# Altium project PCB_DUVBot_v0.00.PrjPCB
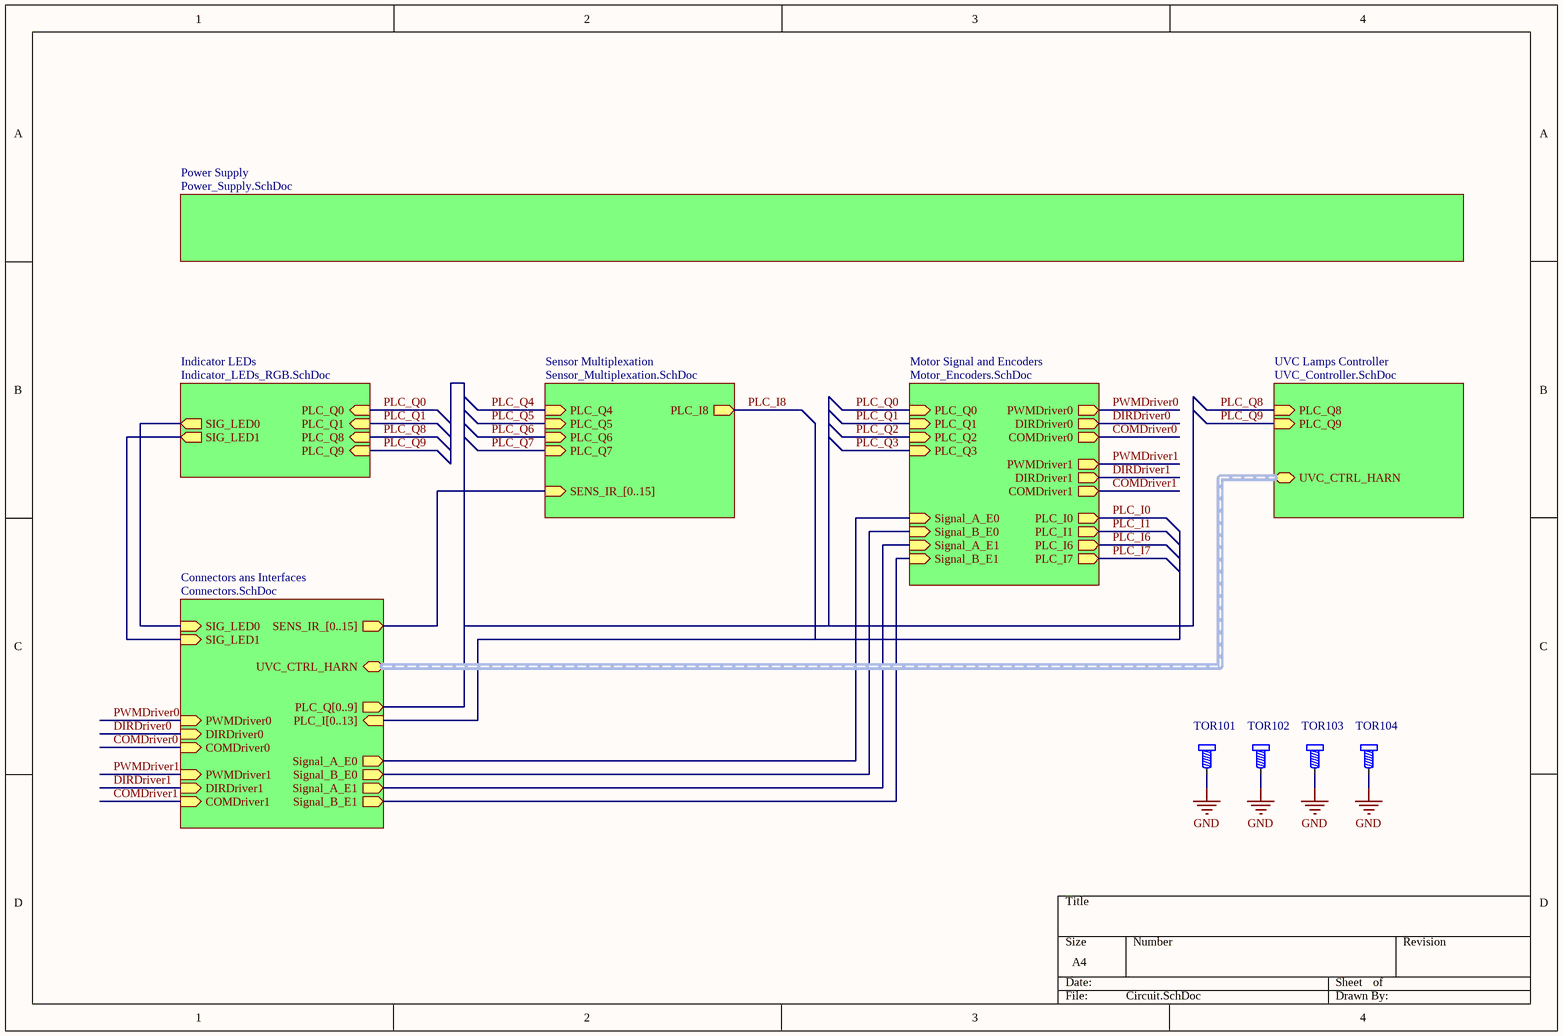
[diagram p0: Circuit.SchDoc]
7 sheets, 218 parts. Net scope: hierarchical (ports join the sheet entries above them; power ports are global).
Board file: PCB_DUVBot_v0.00.PcbDoc
Sheets:
  Circuit.SchDoc
    Indicator LEDs = Indicator_LEDs_RGB.SchDoc
    Sensor Multiplexation = Sensor_Multiplexation.SchDoc
    Power Supply = Power_Supply.SchDoc
    Motor Signal and Encoders = Motor_Encoders.SchDoc
    UVC Lamps Controller = UVC_Controller.SchDoc
    Connectors ans Interfaces = Connectors.SchDoc

## Sheet Circuit.SchDoc
size A4

### Parts
TOR101  SUJETADOR  [TOR_ALEM_M3]  (value not drawn)
TOR102  SUJETADOR  [TOR_ALEM_M3]  (value not drawn)
TOR103  SUJETADOR  [TOR_ALEM_M3]  (value not drawn)
TOR104  SUJETADOR  [TOR_ALEM_M3]  (value not drawn)

### Sub-sheets
Connectors ans Interfaces = Connectors.SchDoc: SENS_IR_[0..15] (out), UVC_CTRL_HARN (harness UVC_CTRL_HARN), PLC_Q[0..9] (out), PLC_I[0..13] (in), Signal_A_E0 (out), Signal_B_E0 (out), Signal_A_E1 (out), Signal_B_E1 (out), PWMDriver0 (in), DIRDriver0 (in), COMDriver0 (in), PWMDriver1 (in), DIRDriver1 (in), COMDriver1 (in), SIG_LED0 (in), SIG_LED1 (in)
Indicator LEDs = Indicator_LEDs_RGB.SchDoc: PLC_Q8 (in), PLC_Q9 (in), PLC_Q0 (in), PLC_Q1 (in), SIG_LED0 (out), SIG_LED1 (out)
Motor Signal and Encoders = Motor_Encoders.SchDoc: PLC_I0 (out), PLC_I6 (out), PLC_Q0 (in), PLC_Q2 (in), PLC_I1 (out), PLC_I7 (out), PLC_Q1 (in), PLC_Q3 (in), DIRDriver0 (out), COMDriver0 (out), DIRDriver1 (out), COMDriver1 (out), Signal_A_E0 (in), Signal_B_E0 (in), Signal_A_E1 (in), Signal_B_E1 (in), PWMDriver0 (out), PWMDriver1 (out)
Power Supply = Power_Supply.SchDoc: no entries
Sensor Multiplexation = Sensor_Multiplexation.SchDoc: SENS_IR_[0..15] (in), PLC_Q4 (in), PLC_Q5 (in), PLC_Q6 (in), PLC_Q7 (in), PLC_I8 (out)
UVC Lamps Controller = UVC_Controller.SchDoc: PLC_Q8 (in), PLC_Q9 (in), UVC_CTRL_HARN (harness UVC_CTRL_HARN)

### Nets
GND: TOR101.1 TOR102.1 TOR103.1 TOR104.1
COMDriver0: sheet Motor Signal and Encoders/COMDriver0, sheet Connectors ans Interfaces/COMDriver0
COMDriver1: sheet Motor Signal and Encoders/COMDriver1, sheet Connectors ans Interfaces/COMDriver1
DIRDriver0: sheet Motor Signal and Encoders/DIRDriver0, sheet Connectors ans Interfaces/DIRDriver0
DIRDriver1: sheet Motor Signal and Encoders/DIRDriver1, sheet Connectors ans Interfaces/DIRDriver1
PLC_Q0: sheet Indicator LEDs/PLC_Q0, sheet Motor Signal and Encoders/PLC_Q0
PLC_Q1: sheet Indicator LEDs/PLC_Q1, sheet Motor Signal and Encoders/PLC_Q1
PLC_Q8: sheet Indicator LEDs/PLC_Q8, sheet UVC Lamps Controller/PLC_Q8
PLC_Q9: sheet Indicator LEDs/PLC_Q9, sheet UVC Lamps Controller/PLC_Q9
PWMDriver0: sheet Motor Signal and Encoders/PWMDriver0, sheet Connectors ans Interfaces/PWMDriver0
PWMDriver1: sheet Motor Signal and Encoders/PWMDriver1, sheet Connectors ans Interfaces/PWMDriver1
SIG_LED0: sheet Indicator LEDs/SIG_LED0, sheet Connectors ans Interfaces/SIG_LED0
SIG_LED1: sheet Indicator LEDs/SIG_LED1, sheet Connectors ans Interfaces/SIG_LED1
Signal_A_E0: sheet Motor Signal and Encoders/Signal_A_E0, sheet Connectors ans Interfaces/Signal_A_E0
Signal_A_E1: sheet Motor Signal and Encoders/Signal_A_E1, sheet Connectors ans Interfaces/Signal_A_E1
Signal_B_E0: sheet Motor Signal and Encoders/Signal_B_E0, sheet Connectors ans Interfaces/Signal_B_E0
Signal_B_E1: sheet Motor Signal and Encoders/Signal_B_E1, sheet Connectors ans Interfaces/Signal_B_E1

### Buses and harness runs
bus sheet Connectors ans Interfaces/SENS_IR_[0..15] = sheet Sensor Multiplexation/SENS_IR_[0..15]
harness sheet Connectors ans Interfaces/UVC_CTRL_HARN = sheet UVC Lamps Controller/UVC_CTRL_HARN

### Library data of the parts
TOR101-TOR104 = Tornillos Sujecion: Agujero para tornillo ed sujecion ed placa; PROVEEDOR: Bultor; CODIGO STI: *; FABRICANTE: *

## Sheet Indicator_LEDs_RGB.SchDoc
size A4
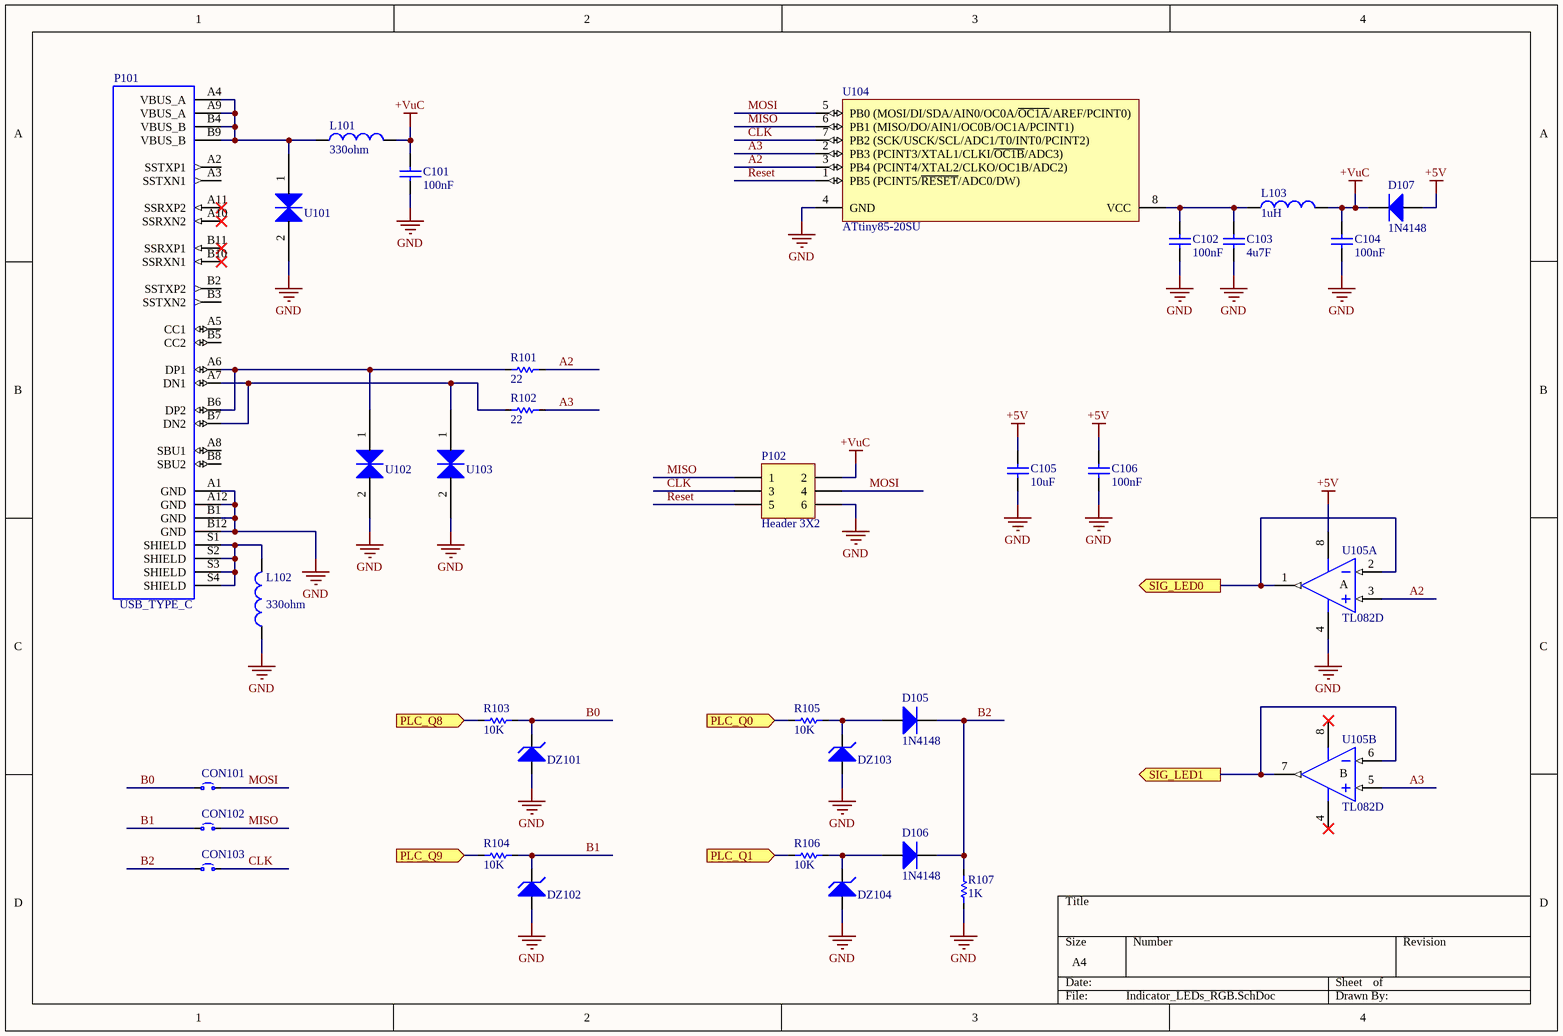
[diagram p1: Indicator_LEDs_RGB.SchDoc]

### Parts
C101  VALOR: 100nF  [C0603]  (hidden comment: Cap Ceramico SMD)
C102  VALOR: 100nF  [C0603]  (hidden comment: Cap Ceramico SMD)
C103  VALOR: 4u7F  [C0603]  (hidden comment: Cap Ceramico SMD)
C104  VALOR: 100nF  [C0603]  (hidden comment: Cap Ceramico SMD)
C105  VALOR: 10uF  [C0603]  (hidden comment: Cap Ceramico SMD)
C106  VALOR: 100nF  [C0603]  (hidden comment: Cap Ceramico SMD)
CON101  Puente  [PUENTE 0805]  (value not drawn)
CON102  Puente  [PUENTE 0805]  (value not drawn)
CON103  Puente  [PUENTE 0805]  (value not drawn)
D105  VALOR: 1N4148  [SOD-80]  (hidden comment: Diodo Rectificador SMD)
D106  VALOR: 1N4148  [SOD-80]  (hidden comment: Diodo Rectificador SMD)
D107  VALOR: 1N4148  [SOD-80]  (hidden comment: Diodo Rectificador SMD)
DZ101  Diodo Zenner SMD  [SOD-80]  (value not drawn)
DZ102  Diodo Zenner SMD  [SOD-80]  (value not drawn)
DZ103  Diodo Zenner SMD  [SOD-80]  (value not drawn)
DZ104  Diodo Zenner SMD  [SOD-80]  (value not drawn)
L101  value 330ohm  [J1-0603]  (hidden comment: Inductor)
L102  value 330ohm  [J1-0603]  (hidden comment: Inductor)
L103  value 1uH  [INDC1608L]  (hidden comment: Inductor)
P101  USB_TYPE_C  [USB_TYPE_C]
P102  Header 3X2  [HDR2X3]
R101  VALOR: 22  [R0603]  (hidden comment: Res SMD)
R102  VALOR: 22  [R0603]  (hidden comment: Res SMD)
R103  VALOR: 10K  [R0603]  (hidden comment: Res SMD)
R104  VALOR: 10K  [R0603]  (hidden comment: Res SMD)
R105  VALOR: 10K  [R0603]  (hidden comment: Res SMD)
R106  VALOR: 10K  [R0603]  (hidden comment: Res SMD)
R107  VALOR: 1K  [R0603]  (hidden comment: Res SMD)
U101  DIODE TVS BIDIR  [J1-0603]  (value not drawn)
U102  DIODE TVS BIDIR  [J1-0603]  (value not drawn)
U103  DIODE TVS BIDIR  [J1-0603]  (value not drawn)
U104  ATtiny85-20SU  [8S2_M]
U105  TL082D  [D008_L]  (parts A,B of 2)

### Ports
PLC_Q0 (in), PLC_Q1 (in), PLC_Q8 (in), PLC_Q9 (in), SIG_LED0 (out), SIG_LED1 (out)

### Nets
+5V: C105.1 C106.1 D107.1(A) U105.8(V+)
+VuC: C101.1 C104.1 D107.2(K) L101.2 L103.2 P102.2
GND: C101.2 C102.2 C103.1 C104.2 C105.2 C106.2 DZ101.1(A) DZ102.1(A) DZ103.1(A) DZ104.1(A) L102.1 P101.A1(GND) P101.A12(GND) P101.B1(GND) P101.B12(GND) P102.6 R107.2 U101.2 U102.2 U103.2 U104.4(GND) U105.4(V-)
A2: R101.1 U104.3(PB4_(PCINT4/XTAL2/CLKO/OC1B/ADC2)) U105.3(IN+)
A3: R102.1 U104.2(PB3_(PCINT3/XTAL1/CLKI/~{OC1B}/ADC3)) U105.5(IN+)
B0: CON101.1 DZ101.2(K) R103.2
B1: CON102.1 DZ102.2(K) R104.2
B2: CON103.1 D105.2(K) D106.2(K) R107.1
CLK: CON103.2 P102.3 U104.7(PB2_(SCK/USCK/SCL/ADC1/T0/INT0/PCINT2))
MISO: CON102.2 P102.1 U104.6(PB1_(MISO/DO/AIN1/OC0B/OC1A/PCINT1))
MOSI: CON101.2 P102.4 U104.5(PB0_(MOSI/DI/SDA/AIN0/OC0A/~{OC1A}/AREF/PCINT0))
PLC_Q0: R105.1 ; port PLC_Q0
PLC_Q1: R106.1 ; port PLC_Q1
PLC_Q8: R103.1 ; port PLC_Q8
PLC_Q9: R104.1 ; port PLC_Q9
Reset: P102.5 U104.1(PB5_(PCINT5/~{RESET}/ADC0/DW))
SIG_LED0: U105.1(OUT) U105.2(IN-) ; port SIG_LED0
SIG_LED1: U105.6(IN-) U105.7(OUT) ; port SIG_LED1
NetC102_1: C102.1 C103.2 L103.1 U104.8(VCC)
NetD105_1: D105.1(A) DZ103.2(K) R105.2
NetD106_1: D106.1(A) DZ104.2(K) R106.2
NetL101_1: L101.1 P101.A4(VBUS_A) P101.A9(VBUS_A) P101.B4(VBUS_B) P101.B9(VBUS_B) U101.1
NetL102_2: L102.2 P101.S1(SHIELD) P101.S2(SHIELD) P101.S3(SHIELD) P101.S4(SHIELD)
NetP101_A6: P101.A6(DP1) P101.B6(DP2) R101.2 U102.1
NetP101_A7: P101.A7(DN1) P101.B7(DN2) R102.2 U103.1

Not connected (* = marked no-connect by the designer): P101 A2(SSTXP1) A3(SSTXN1) A5(CC1) A8(SBU1) A10(SSRXN2)* A11(SSRXP2)* B2(SSTXP2) B3(SSTXN2) B5(CC2) B8(SBU2) B10(SSRXN1)* B11(SSRXP1)*

### Notes on the sheet
- (in symbol TL082D, part A) A
- (in symbol TL082D, part B) B

### Library data of the parts
C101-C106 = Cap Ceramico SMD: Cap Ceramico SMD 0805; CODIGO RUF: *; PROVEEDOR: *; FABRICANTE: *
  C101 C102 C104 C106: Arrow: C0603C104K5RACAUTO; Digikey: 399-6856-1-ND
  C103: Arrow: CL10A475KP8NNNC; Digikey: 1276-1044-1-ND
  C105: Arrow: CL10A106MQ8NNNC; Digikey: 1276-1119-1-ND
D105-D107 = Diodo Rectificador SMD: Diodo Rectificador; PROVEEDOR: *; CODIGO RUF: *; FABRIANTE: *; Arrow: FDLL4148; Digikey: FDLL4148TR-ND
DZ101 DZ102 DZ104 = Diodo Zenner SMD: VALOR: 5V1; PROVEEDOR: *; CODIGO RUF: *; FABRICANTE: *; Arrow: BZT55C5V1-GS08; Digikey: BZT55C5V1-GS08GICT-ND
DZ103 = Diodo Zenner SMD: VALOR: 5V6; PROVEEDOR: *; CODIGO RUF: *; FABRICANTE: *; Arrow: BZT55C5V6-GS08; Digikey: BZT55C5V6-GS08GICT-ND
L101-L103 = Inductor: Code_IEC: 1005; Published: 8-Jun-2000; LatestRevisionDate: 29-May-2009; LatestRevisionNote: IPC-7351 Footprint Added.; PackageReference: 0402-A; Publisher: Altium Limited; PackageDescription: Chip Inductor; Code_JEITA: 0402
  L101 L102: DigiKey: 445-5221-1-ND; Arrow: MPZ1608S331ATA00
  L103: Arrow: ASMPH-0603-1R0M-T; Digikey: 535-12263-1-ND
P101 = USB Type C: USB - C _Type - C_ USB 3.1 _USB 3.1 Gen 2, Superspeed+_ Receptacle Connector 24 Position Surface Mount, Right Angle; Through Hole; MF: Amphenol ICC; MP: 10137062-00021LF; Package: None; Price: None; Availability: Unavailable; SnapEDA_Link: https://www.snapeda.com/parts/10137062-00021LF/Amphenol%20ICC/view-part/2697942/?ref=snap; Value: *; Arrow: 10137062-00021LF; Digikey: 609-6109-1-ND
P102 = Header 3X2: Header, 3-Pin, Dual row; LatestRevisionDate: 17-Jul-2002; LatestRevisionNote: Re-released for DXP Platform.; Publisher: Altium Limited; Arrow: *; Digikey: *
U101-U103 = DIODE TVS BIDIRECTIONAL: DigiKey: 283-2791-1-ND; Arrow: 0603ESDA-MLP7
U104 = ATtiny85-20SU: Low Power tinyAVR® 8-Bit Microcontroller, 8K Flash Memory, 20MHz, Industrial Temperature, 8-Lead SOIC, Pb-Free; Published: 20-Nov-2009; DatasheetVersion: DOC2586I, May-2008; PackageVersion: revF, Apr-2008; PackageReference: 8S2; Publisher: Altium Limited; PackageDescription: 8-Lead, 0.208" Body, Plastic Small Outline Package (EIAJ); Supplier 1: Digi-Key; Supplier Part Number 1: ATTINY85-20SU-ND; Supplier 2: Farnell; Supplier Part Number 2: 1455164; Supplier 3: Mouser; Supplier Part Number 3: 556-ATTINY85-20SU; ComponentLink1Description: Manufacturer Link; ComponentLink1URL: http://www.atmel.com/products/AVR/tinyavr.asp?; ComponentLink2Description: Datasheet; ComponentLink2URL: http://www.atmel.com/dyn/resources/prod_documents/doc2586.pdf; ComponentLink3Description: Atmel.com Home; ComponentLink3URL: http://www.atmel.com; Arrow: ATTINY85-20SU; Digikey: ATTINY85-20SU-ND
U105 = TL082D: JFET-Input Operational Amplifier; Published: 16-Jan-2001; LatestRevisionDate: 13-Apr-2006; LatestRevisionNote: IPC-7351 Footprint Added.; DatasheetVersion: Feb-1999; PackageVersion: Jan-1998; PackageReference: D008; Publisher: Altium Limited; PackageDescription: 8-Pin Small Outline Integrated Circuit 1.27 mm Pitch; Code_IPC: SOIC127P600-8; ComponentLink1Description: Manufacturer Link; ComponentLink1URL: http://www.ti.com/; ComponentLink2Description: Datasheet; ComponentLink2URL: http://www-s.ti.com/sc/ds/tl082.pdf; Arrow: TL082IDR; Digikey: 296-15005-1-ND
CON101-CON103 = Puente: Digikey: RMCF0805ZT0R00CT-ND; Arrow: RMCF0805ZT0R00
R101-R107 = Res SMD: CODIGO RUF: *; PROVEEDOR: *; FABRICANTE: *
  R101 R102: Arrow: CRCW060322R0FKEAC; Digikey: 541-4025-1-ND
  R103-R106: Arrow: MCT06030C1002FP500; Digikey: RMCF0603FT10K0CT-ND
  R107: Arrow: RCA06031K00FKEA; Digikey: YAG2323CT-ND

## Sheet Sensor_Multiplexation.SchDoc
size A4
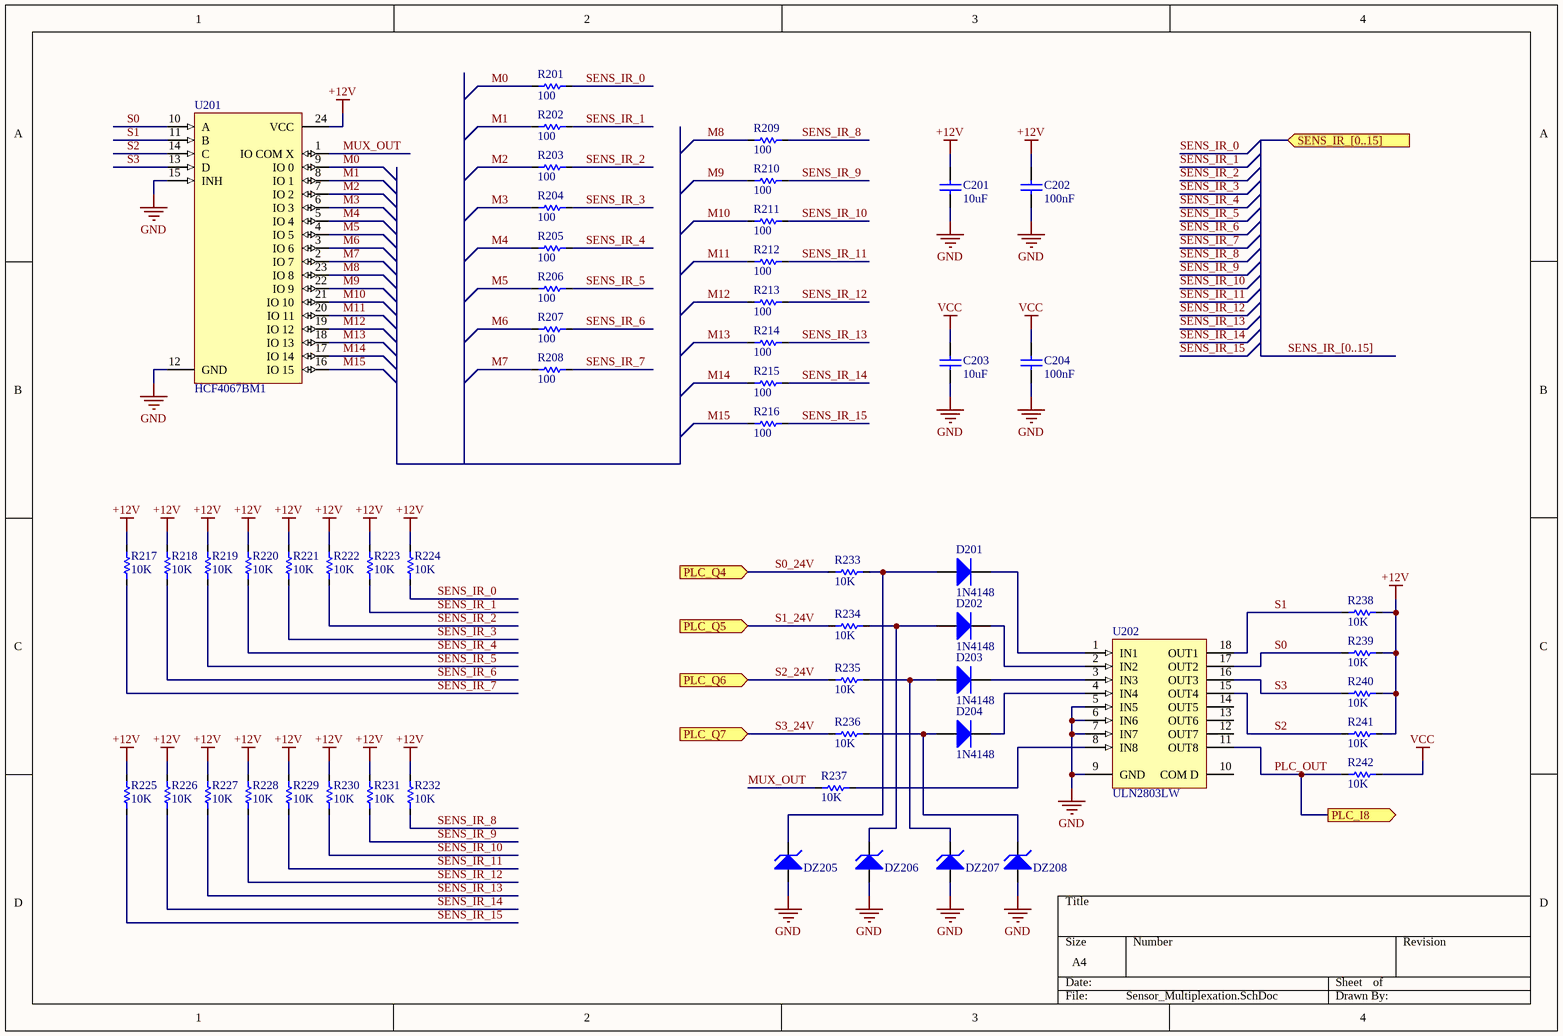
[diagram p2: Sensor_Multiplexation.SchDoc]

### Parts
C201  VALOR: 10uF  [C0603]  (hidden comment: Cap Ceramico SMD)
C202  VALOR: 100nF  [C0603]  (hidden comment: Cap Ceramico SMD)
C203  VALOR: 10uF  [C0603]  (hidden comment: Cap Ceramico SMD)
C204  VALOR: 100nF  [C0603]  (hidden comment: Cap Ceramico SMD)
D201  VALOR: 1N4148  [SOD-80]  (hidden comment: Diodo Rectificador SMD)
D202  VALOR: 1N4148  [SOD-80]  (hidden comment: Diodo Rectificador SMD)
D203  VALOR: 1N4148  [SOD-80]  (hidden comment: Diodo Rectificador SMD)
D204  VALOR: 1N4148  [SOD-80]  (hidden comment: Diodo Rectificador SMD)
DZ205  Diodo Zenner SMD  [SOD-80]  (value not drawn)
DZ206  Diodo Zenner SMD  [SOD-80]  (value not drawn)
DZ207  Diodo Zenner SMD  [SOD-80]  (value not drawn)
DZ208  Diodo Zenner SMD  [SOD-80]  (value not drawn)
R201  VALOR: 100  [R0603]  (hidden comment: Res SMD)
R202  VALOR: 100  [R0603]  (hidden comment: Res SMD)
R203  VALOR: 100  [R0603]  (hidden comment: Res SMD)
R204  VALOR: 100  [R0603]  (hidden comment: Res SMD)
R205  VALOR: 100  [R0603]  (hidden comment: Res SMD)
R206  VALOR: 100  [R0603]  (hidden comment: Res SMD)
R207  VALOR: 100  [R0603]  (hidden comment: Res SMD)
R208  VALOR: 100  [R0603]  (hidden comment: Res SMD)
R209  VALOR: 100  [R0603]  (hidden comment: Res SMD)
R210  VALOR: 100  [R0603]  (hidden comment: Res SMD)
R211  VALOR: 100  [R0603]  (hidden comment: Res SMD)
R212  VALOR: 100  [R0603]  (hidden comment: Res SMD)
R213  VALOR: 100  [R0603]  (hidden comment: Res SMD)
R214  VALOR: 100  [R0603]  (hidden comment: Res SMD)
R215  VALOR: 100  [R0603]  (hidden comment: Res SMD)
R216  VALOR: 100  [R0603]  (hidden comment: Res SMD)
R217  VALOR: 10K  [R0603]  (hidden comment: Res SMD)
R218  VALOR: 10K  [R0603]  (hidden comment: Res SMD)
R219  VALOR: 10K  [R0603]  (hidden comment: Res SMD)
R220  VALOR: 10K  [R0603]  (hidden comment: Res SMD)
R221  VALOR: 10K  [R0603]  (hidden comment: Res SMD)
R222  VALOR: 10K  [R0603]  (hidden comment: Res SMD)
R223  VALOR: 10K  [R0603]  (hidden comment: Res SMD)
R224  VALOR: 10K  [R0603]  (hidden comment: Res SMD)
R225  VALOR: 10K  [R0603]  (hidden comment: Res SMD)
R226  VALOR: 10K  [R0603]  (hidden comment: Res SMD)
R227  VALOR: 10K  [R0603]  (hidden comment: Res SMD)
R228  VALOR: 10K  [R0603]  (hidden comment: Res SMD)
R229  VALOR: 10K  [R0603]  (hidden comment: Res SMD)
R230  VALOR: 10K  [R0603]  (hidden comment: Res SMD)
R231  VALOR: 10K  [R0603]  (hidden comment: Res SMD)
R232  VALOR: 10K  [R0603]  (hidden comment: Res SMD)
R233  VALOR: 10K  [R0603]  (hidden comment: Res SMD)
R234  VALOR: 10K  [R0603]  (hidden comment: Res SMD)
R235  VALOR: 10K  [R0603]  (hidden comment: Res SMD)
R236  VALOR: 10K  [R0603]  (hidden comment: Res SMD)
R237  VALOR: 10K  [R0603]  (hidden comment: Res SMD)
R238  VALOR: 10K  [R0603]  (hidden comment: Res SMD)
R239  VALOR: 10K  [R0603]  (hidden comment: Res SMD)
R240  VALOR: 10K  [R0603]  (hidden comment: Res SMD)
R241  VALOR: 10K  [R0603]  (hidden comment: Res SMD)
R242  VALOR: 10K  [R0603]  (hidden comment: Res SMD)
U201  HCF4067BM1  [SO24_M]
U202  ULN2803LW  [LW18_M]

### Ports
PLC_I8 (out), PLC_Q4 (in), PLC_Q5 (in), PLC_Q6 (in), PLC_Q7 (in), SENS_IR_[0..15] (in)

### Nets
+12V: C201.1 C202.1 R217.1 R218.1 R219.1 R220.1 R221.1 R222.1 R223.1 R224.1 R225.1 R226.1 R227.1 R228.1 R229.1 R230.1 R231.1 R232.1 R238.2 R239.2 R240.2 R241.2 U201.24(VCC)
GND: C201.2 C202.2 C203.2 C204.2 DZ205.1(A) DZ206.1(A) DZ207.1(A) DZ208.1(A) U201.12(GND) U201.15(INH) U202.5(IN5) U202.6(IN6) U202.7(IN7) U202.9(GND)
VCC: C203.1 C204.1 R242.2
M0: R201.2 U201.9(IO_0)
M1: R202.2 U201.8(IO_1)
M2: R203.2 U201.7(IO_2)
M3: R204.2 U201.6(IO_3)
M4: R205.2 U201.5(IO_4)
M5: R206.2 U201.4(IO_5)
M6: R207.2 U201.3(IO_6)
M7: R208.2 U201.2(IO_7)
M8: R209.2 U201.23(IO_8)
M9: R210.2 U201.22(IO_9)
M10: R211.2 U201.21(IO_10)
M11: R212.2 U201.20(IO_11)
M12: R213.2 U201.19(IO_12)
M13: R214.2 U201.18(IO_13)
M14: R215.2 U201.17(IO_14)
M15: R216.2 U201.16(IO_15)
MUX_OUT: R237.1 U201.1(IO_COM_X)
PLC_OUT: R242.1 U202.11(OUT8) ; port PLC_I8  [project net PLC_I8]
S0: R239.1 U201.10(A) U202.17(OUT2)
S0_24V: R233.1 ; port PLC_Q4  [project net PLC_Q4]
S1: R238.1 U201.11(B) U202.18(OUT1)
S1_24V: R234.1 ; port PLC_Q5  [project net PLC_Q5]
S2: R241.1 U201.14(C) U202.15(OUT4)
S2_24V: R235.1 ; port PLC_Q6  [project net PLC_Q6]
S3: R240.1 U201.13(D) U202.16(OUT3)
S3_24V: R236.1 ; port PLC_Q7  [project net PLC_Q7]
SENS_IR_0: R201.1 R224.2
SENS_IR_1: R202.1 R223.2
SENS_IR_2: R203.1 R222.2
SENS_IR_3: R204.1 R221.2
SENS_IR_4: R205.1 R220.2
SENS_IR_5: R206.1 R219.2
SENS_IR_6: R207.1 R218.2
SENS_IR_7: R208.1 R217.2
SENS_IR_8: R209.1 R232.2
SENS_IR_9: R210.1 R231.2
SENS_IR_10: R211.1 R230.2
SENS_IR_11: R212.1 R229.2
SENS_IR_12: R213.1 R228.2
SENS_IR_13: R214.1 R227.2
SENS_IR_14: R215.1 R226.2
SENS_IR_15: R216.1 R225.2
NetD201_1: D201.1(A) DZ205.2(K) R233.2
NetD201_2: D201.2(K) U202.1(IN1)
NetD202_1: D202.1(A) DZ206.2(K) R234.2
NetD202_2: D202.2(K) U202.2(IN2)
NetD203_1: D203.1(A) DZ207.2(K) R235.2
NetD203_2: D203.2(K) U202.3(IN3)
NetD204_1: D204.1(A) DZ208.2(K) R236.2
NetD204_2: D204.2(K) U202.4(IN4)
NetR237_2: R237.2 U202.8(IN8)

Not connected (* = marked no-connect by the designer): U202 10(COM_D) 12(OUT7) 13(OUT6) 14(OUT5)

### Buses and harness runs
bus SENS_IR_[0..15] = port SENS_IR_[0..15]

### Library data of the parts
C201-C204 = Cap Ceramico SMD: Cap Ceramico SMD 0805; CODIGO RUF: *; PROVEEDOR: *; FABRICANTE: *
  C201 C203: Arrow: CL10A106MQ8NNNC; Digikey: 1276-1119-1-ND
  C202 C204: Arrow: C0603C104K5RACAUTO; Digikey: 399-6856-1-ND
D201-D204 = Diodo Rectificador SMD: Diodo Rectificador; PROVEEDOR: *; CODIGO RUF: *; FABRIANTE: *; Arrow: FDLL4148; Digikey: FDLL4148TR-ND
U201 = HCF4067BM1: Analog Multiplexer/Demultiplexer; Published: 8-Jun-2000; LatestRevisionDate: 13-Apr-2006; LatestRevisionNote: IPC-7351 Footprint Added.; DatasheetVersion: Sep-1988; PackageVersion: Oct-2001; PackageReference: SO24; Publisher: Altium Limited; PackageDescription: 24-Pin Plastic Small Outline Integrated Circuit 1.27 mm Pitch; ComponentLink1Description: Manufacturer Link; ComponentLink1URL: http://www.st.com/; ComponentLink2Description: Datasheet; ComponentLink2URL: http://www.st.com/stonline/products/literature/ds/2058/hcf4067.pdf; Arrow: MC74HC4067ADWR2G; Digikey: MC74HC4067ADWR2GOSCT-ND
U202 = ULN2803LW: High-Voltage, High-Current Darlington Array; Published: 13-Oct-2000; LatestRevisionDate: 13-Apr-2006; LatestRevisionNote: IPC-7351 Footprint Added.; DatasheetVersion: 1999; PackageReference: LW18; Publisher: Altium Limited; PackageDescription: 18-Pin Small Outline Integrated Circuit 1.27 mm Pitch; Code_JEDEC: MS-013-AB; ComponentLink1Description: Manufacturer Link; ComponentLink1URL: http://www.allegromicro.com/; Arrow: ULN2803ADW; Digikey: ULN2803ADW-ND
DZ205-DZ208 = Diodo Zenner SMD: VALOR: *; PROVEEDOR: *; CODIGO RUF: *; FABRICANTE: *; Arrow: TLZ10C-GS08; Digikey: 112-TLZ10C-GS08CT-ND
R201-R242 = Res SMD: CODIGO RUF: *; PROVEEDOR: *; FABRICANTE: *
  R201-R216: Arrow: RC0603FR-07100RL; Digikey: 311-100HRCT-ND
  R217-R242: Arrow: MCT06030C1002FP500; Digikey: RMCF0603FT10K0CT-ND

## Sheet Power_Supply.SchDoc
size A4
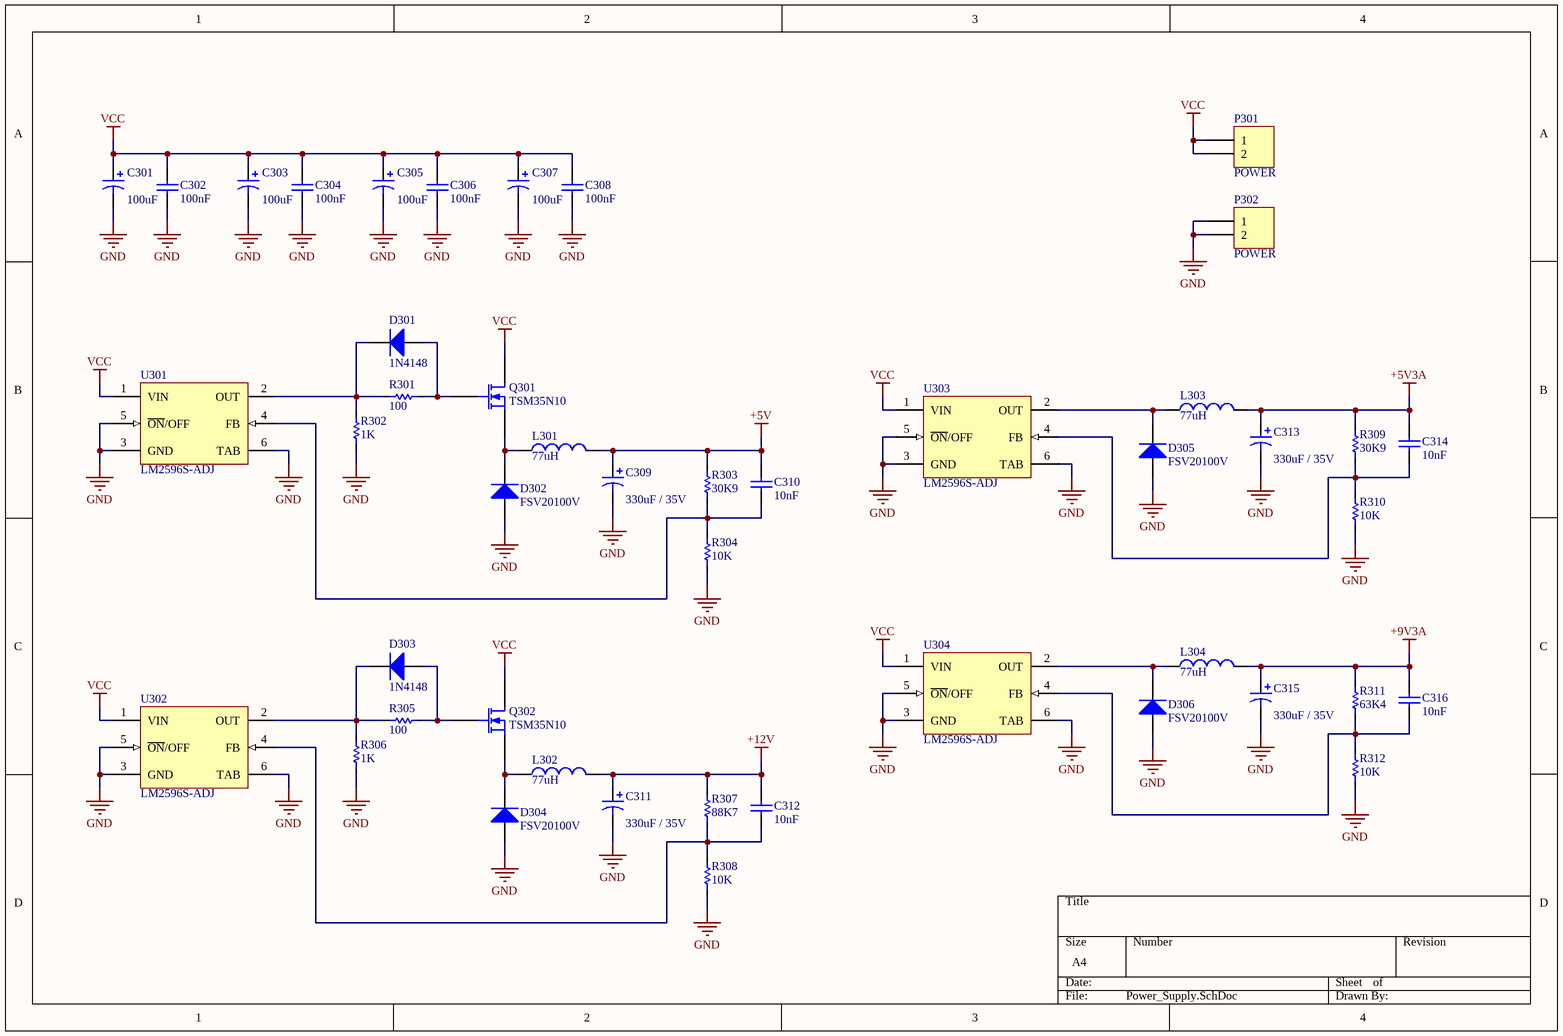
[diagram p3: Power_Supply.SchDoc]

### Parts
C301  value 100uF  [F55]  (hidden comment: Cap Pol3)
C302  VALOR: 100nF  [C0603]  (hidden comment: Cap Ceramico SMD)
C303  value 100uF  [F55]  (hidden comment: Cap Pol3)
C304  VALOR: 100nF  [C0603]  (hidden comment: Cap Ceramico SMD)
C305  value 100uF  [F55]  (hidden comment: Cap Pol3)
C306  VALOR: 100nF  [C0603]  (hidden comment: Cap Ceramico SMD)
C307  value 100uF  [F55]  (hidden comment: Cap Pol3)
C308  VALOR: 100nF  [C0603]  (hidden comment: Cap Ceramico SMD)
C309  value 330uF / 35V  [MCL1GS]  (hidden comment: Cap Pol3)
C310  VALOR: 10nF  [C0603]  (hidden comment: Cap Ceramico SMD)
C311  value 330uF / 35V  [MCL1GS]  (hidden comment: Cap Pol3)
C312  VALOR: 10nF  [C0603]  (hidden comment: Cap Ceramico SMD)
C313  value 330uF / 35V  [MCL1GS]  (hidden comment: Cap Pol3)
C314  VALOR: 10nF  [C0603]  (hidden comment: Cap Ceramico SMD)
C315  value 330uF / 35V  [MCL1GS]  (hidden comment: Cap Pol3)
C316  VALOR: 10nF  [C0603]  (hidden comment: Cap Ceramico SMD)
D301  VALOR: 1N4148  [SOD-80]  (hidden comment: Diodo Rectificador SMD)
D302  VALOR: FSV20100V  [TO-277-3]  (hidden comment: Diodo Rectificador SMD)
D303  VALOR: 1N4148  [SOD-80]  (hidden comment: Diodo Rectificador SMD)
D304  VALOR: FSV20100V  [TO-277-3]  (hidden comment: Diodo Rectificador SMD)
D305  VALOR: FSV20100V  [TO-277-3]  (hidden comment: Diodo Rectificador SMD)
D306  VALOR: FSV20100V  [TO-277-3]  (hidden comment: Diodo Rectificador SMD)
L301  value 77uH  [KM-3.0]  (hidden comment: Inductor)
L302  value 77uH  [KM-3.0]  (hidden comment: Inductor)
L303  value 77uH  [KM-3.0]  (hidden comment: Inductor)
L304  value 77uH  [KM-3.0]  (hidden comment: Inductor)
P301  POWER  [Terminal_2way_508]
P302  POWER  [Terminal_2way_508]
Q301  TSM35N10  [TO-252AA_A_M]
Q302  TSM35N10  [TO-252AA_A_M]
R301  VALOR: 100  [R0603]  (hidden comment: Res SMD)
R302  VALOR: 1K  [R0603]  (hidden comment: Res SMD)
R303  VALOR: 30K9  [R0603]  (hidden comment: Res SMD)
R304  VALOR: 10K  [R0603]  (hidden comment: Res SMD)
R305  VALOR: 100  [R0603]  (hidden comment: Res SMD)
R306  VALOR: 1K  [R0603]  (hidden comment: Res SMD)
R307  VALOR: 88K7  [R0603]  (hidden comment: Res SMD)
R308  VALOR: 10K  [R0603]  (hidden comment: Res SMD)
R309  VALOR: 30K9  [R0603]  (hidden comment: Res SMD)
R310  VALOR: 10K  [R0603]  (hidden comment: Res SMD)
R311  VALOR: 63K4  [R0603]  (hidden comment: Res SMD)
R312  VALOR: 10K  [R0603]  (hidden comment: Res SMD)
U301  LM2596S-ADJ  [TS5B_M]
U302  LM2596S-ADJ  [TS5B_M]
U303  LM2596S-ADJ  [TS5B_M]
U304  LM2596S-ADJ  [TS5B_M]

### Nets
+5V: C309.1 C310.1 L301.2 R303.1
+5V3A: C313.1 C314.1 L303.2 R309.1
+9V3A: C315.1 C316.1 L304.2 R311.1
+12V: C311.1 C312.1 L302.2 R307.1
GND: C301.2 C302.2 C303.2 C304.2 C305.2 C306.2 C307.2 C308.2 C309.2 C311.2 C313.2 C315.2 D302.1(A) D304.1(A) D305.1(A) D306.1(A) P302.1 P302.2 R302.2 R304.2 R306.2 R308.2 R310.2 R312.2 U301.3(GND) U301.5(~{ON}/OFF) U301.6(TAB) U302.3(GND) U302.5(~{ON}/OFF) U302.6(TAB) U303.3(GND) U303.5(~{ON}/OFF) U303.6(TAB) U304.3(GND) U304.5(~{ON}/OFF) U304.6(TAB)
VCC: C301.1 C302.1 C303.1 C304.1 C305.1 C306.1 C307.1 C308.1 P301.1 P301.2 Q301.4(D) Q302.4(D) U301.1(VIN) U302.1(VIN) U303.1(VIN) U304.1(VIN)
NetC310_2: C310.2 R303.2 R304.1 U301.4(FB)
NetC312_2: C312.2 R307.2 R308.1 U302.4(FB)
NetC314_2: C314.2 R309.2 R310.1 U303.4(FB)
NetC316_2: C316.2 R311.2 R312.1 U304.4(FB)
NetD301_1: D301.1(A) Q301.1(G) R301.1
NetD301_2: D301.2(K) R301.2 R302.1 U301.2(OUT)
NetD302_2: D302.2(K) L301.1 Q301.3(S)
NetD303_1: D303.1(A) Q302.1(G) R305.1
NetD303_2: D303.2(K) R305.2 R306.1 U302.2(OUT)
NetD304_2: D304.2(K) L302.1 Q302.3(S)
NetD305_2: D305.2(K) L303.1 U303.2(OUT)
NetD306_2: D306.2(K) L304.1 U304.2(OUT)

### Library data of the parts
C301 C303 C305 C307 C309 C311 C313 C315 = Cap Pol3: Polarized Capacitor (Surface Mount); Published: 8-Jun-2000; LatestRevisionDate: 29-May-2009; LatestRevisionNote: IPC-7351 Footprint Added.; PackageReference: C0805; Publisher: Altium Limited; PackageDescription: Chip Capacitor
  C301 C303 C305 C307: DigiKey: 493-2105-1-ND; Arrow: UWX1C101MCL1GB
  C309 C311 C313 C315: DigiKey: 493-2206-2-ND; Arrow: UWT1V331MNL1GS
C302 C304 C306 C308 C310 C312 C314 C316 = Cap Ceramico SMD: Cap Ceramico SMD 0805; CODIGO RUF: *; PROVEEDOR: *; FABRICANTE: *
  C302 C304 C306 C308: Arrow: C0603C104K5RACAUTO; Digikey: 399-6856-1-ND
  C310 C312 C314 C316: Arrow: 06035C103KAT4A; Digikey: 478-10055-1-ND
D301-D306 = Diodo Rectificador SMD: Diodo Rectificador; PROVEEDOR: *; CODIGO RUF: *; FABRIANTE: *
  D301 D303: Arrow: FDLL4148; Digikey: FDLL4148TR-ND
  D302 D304-D306: Arrow: FSV20100V; Digikey: FSV20100VCT-ND
L301-L304 = Inductor: Code_IEC: 1005; Published: 8-Jun-2000; LatestRevisionDate: 29-May-2009; LatestRevisionNote: IPC-7351 Footprint Added.; PackageReference: 0402-A; Publisher: Altium Limited; PackageDescription: Chip Inductor; Code_JEITA: 0402; DigiKey: 553-2112-ND; Arrow: PE-54044NL
P301 P302 = Header 2: Header, 2-Pin; LatestRevisionDate: 17-Jul-2002; LatestRevisionNote: Re-released for DXP Platform.; Publisher: Altium Limited; Arrow: TB007-508-02BE; Digikey: 102-6203-ND
Q301 Q302 = MOSFET-N: N-Channel MOSFET; Published: 8-Jun-2000; LatestRevisionDate: 17-Jul-2002; LatestRevisionNote: Re-released for DXP Platform.; PackageVersion: 1995/1996; PackageReference: E3; Publisher: Altium Limited; PackageDescription: TO, Flat Index; 3 In-Line, Axial Leads; Body Dia. 4.6mm; Lead Dia. 0.5 mm (max); Arrow: TSM35N10CP ROG; Digikey: TSM35N10CPROGTR-ND
U301-U304 = LM2596S-ADJ: SIMPLE SWITCHER® Power Converter 150 KHz 3A Step-Down Voltage Regulator, 5-pin TO-263; Manufacturer: National Semiconductor; PackageTopMarking: NSUZXYTTE#*LM2596S*-ADJ P+; PowerWise: N; Published: 4-Dec-2008; DatasheetVersion: May-2002; PackageVersion: revD, Apr-2005; PackageReference: TS5B; Publisher: Altium Limited; PackageDescription: TO-263, Molded, .400 x .390 x .180in, 5 Lead, .067in Pitch, Surface Mount; Supplier 1: Farnell; Supplier Part Number 1: 1523864; Supplier 2: Farnell; Supplier Part Number 2: 9494367; PartNumber: LM2596S-ADJ; RoHS: N; PinCount: 5; CompType: Switcher; Code_JEDEC: MO-169-AB; ComponentLink1Description: LM2596 Datasheet; ComponentLink1URL: http://www.national.com/ds/LM/LM2596.pdf; ComponentLink2Description: LM2596 Web Page; ComponentLink2URL: http://www.national.com/pf/LM/LM2596.html; ComponentLink3Description: TS5B Package Page; ComponentLink3URL: http://www.national.com/packaging/folders/ts5b.html; Arrow: LM2596DSADJR4G; Digikey: LM2596DSADJR4GOSCT-ND
R301-R312 = Res SMD: CODIGO RUF: *; PROVEEDOR: *; FABRICANTE: *
  R301 R305: Arrow: RC0603FR-07100RL; Digikey: 311-100HRCT-ND
  R302 R306: Arrow: RCA06031K00FKEA; Digikey: YAG2323CT-ND
  R303 R309: Arrow: CRCW060330K9FKEAHP; Digikey: 541-30.9KHCT-ND
  R304 R308 R310 R312: Arrow: MCT06030C1002FP500; Digikey: RMCF0603FT10K0CT-ND
  R307: Arrow: RMCF0603FT88K7; Digikey: 738-RMCF0603FT88K7CT-ND
  R311: Arrow: RMCF0603FT63K4; Digikey: RMCF0603FT63K4CT-ND

## Sheet Motor_Encoders.SchDoc
size A4
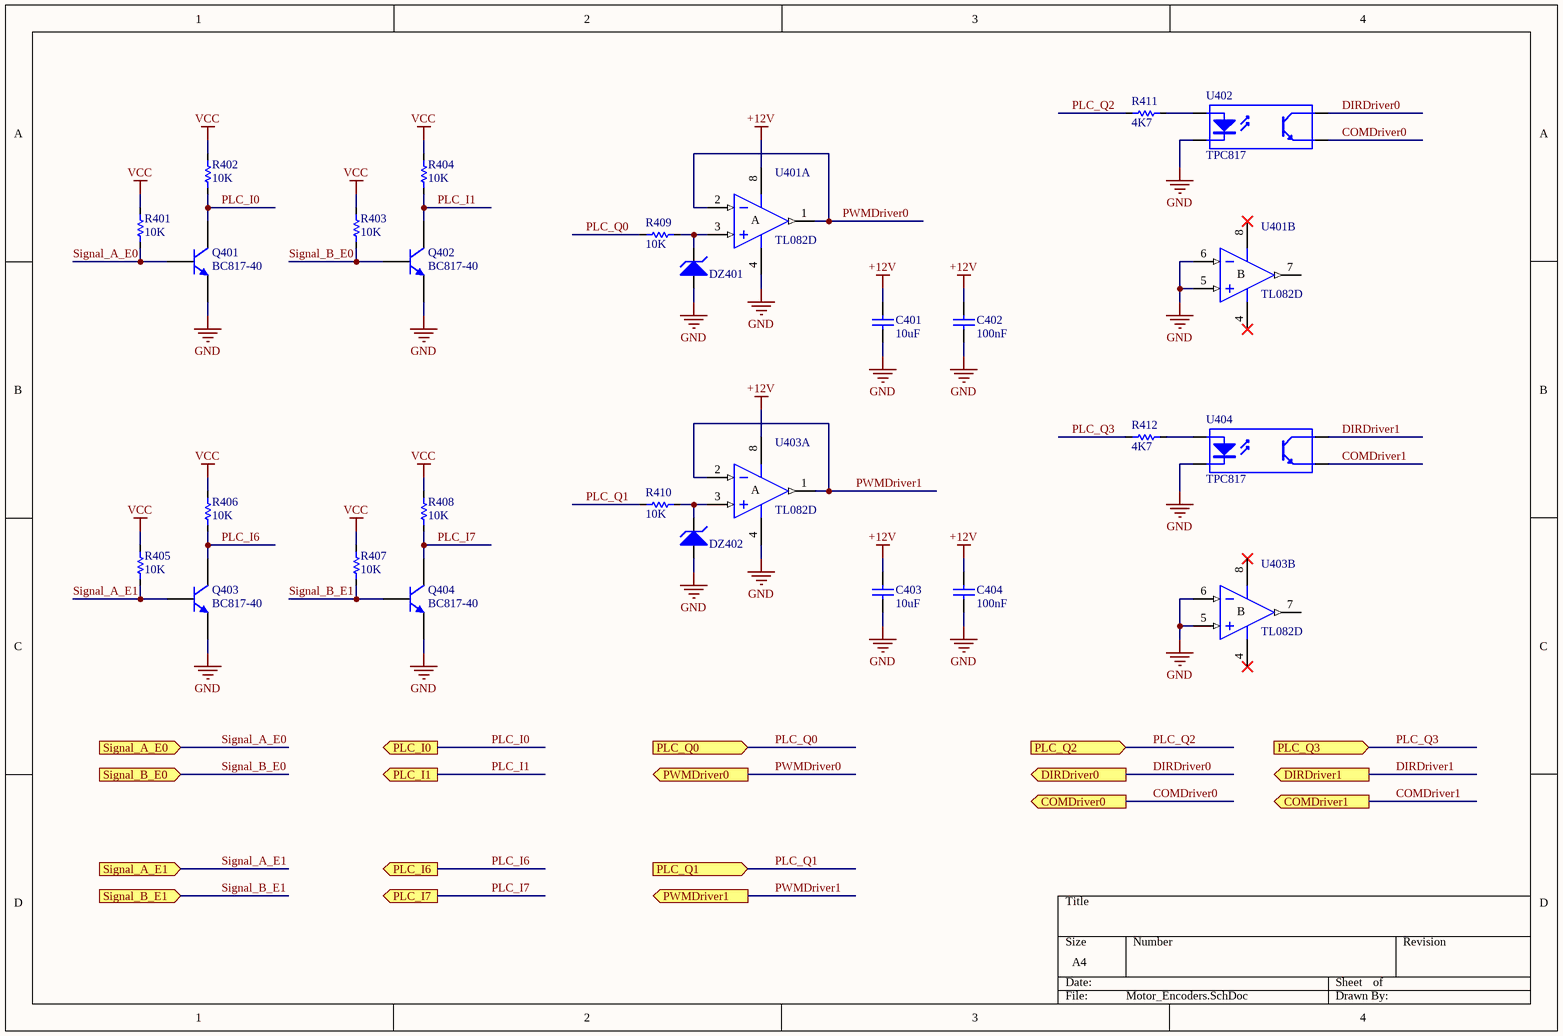
[diagram p4: Motor_Encoders.SchDoc]

### Parts
C401  VALOR: 10uF  [C0603]  (hidden comment: Cap Ceramico SMD)
C402  VALOR: 100nF  [C0603]  (hidden comment: Cap Ceramico SMD)
C403  VALOR: 10uF  [C0603]  (hidden comment: Cap Ceramico SMD)
C404  VALOR: 100nF  [C0603]  (hidden comment: Cap Ceramico SMD)
DZ401  Diodo Zenner SMD  [SOD-80]  (value not drawn)
DZ402  Diodo Zenner SMD  [SOD-80]  (value not drawn)
Q401  BC817-40  [SOT23_M]
Q402  BC817-40  [SOT23_M]
Q403  BC817-40  [SOT23_M]
Q404  BC817-40  [SOT23_M]
R401  VALOR: 10K  [R0603]  (hidden comment: Res SMD)
R402  VALOR: 10K  [R0603]  (hidden comment: Res SMD)
R403  VALOR: 10K  [R0603]  (hidden comment: Res SMD)
R404  VALOR: 10K  [R0603]  (hidden comment: Res SMD)
R405  VALOR: 10K  [R0603]  (hidden comment: Res SMD)
R406  VALOR: 10K  [R0603]  (hidden comment: Res SMD)
R407  VALOR: 10K  [R0603]  (hidden comment: Res SMD)
R408  VALOR: 10K  [R0603]  (hidden comment: Res SMD)
R409  VALOR: 10K  [R0603]  (hidden comment: Res SMD)
R410  VALOR: 10K  [R0603]  (hidden comment: Res SMD)
R411  VALOR: 4K7  [R0603]  (hidden comment: Res SMD)
R412  VALOR: 4K7  [R0603]  (hidden comment: Res SMD)
U401  TL082D  [D008_L]  (parts A,B of 2)
U402  TPC817  [DIP-4]
U403  TL082D  [D008_L]  (parts A,B of 2)
U404  TPC817  [DIP-4]

### Ports
COMDriver0 (out), COMDriver1 (out), DIRDriver0 (out), DIRDriver1 (out), PLC_I0 (out), PLC_I1 (out), PLC_I6 (out), PLC_I7 (out), PLC_Q0 (in), PLC_Q1 (in), PLC_Q2 (in), PLC_Q3 (in), PWMDriver0 (out), PWMDriver1 (out), Signal_A_E0 (in), Signal_A_E1 (in), Signal_B_E0 (in), Signal_B_E1 (in)

### Nets
+12V: C401.1 C402.1 C403.1 C404.1 U401.8(V+) U403.8(V+)
GND: C401.2 C402.2 C403.2 C404.2 DZ401.1(A) DZ402.1(A) Q401.2(E) Q402.2(E) Q403.2(E) Q404.2(E) U401.4(V-) U401.5(IN+) U401.6(IN-) U402.2(K) U403.4(V-) U403.5(IN+) U403.6(IN-) U404.2(K)
VCC: R401.1 R402.1 R403.1 R404.1 R405.1 R406.1 R407.1 R408.1
COMDriver0: U402.3(E) ; port COMDriver0
COMDriver1: U404.3(E) ; port COMDriver1
DIRDriver0: U402.4(C) ; port DIRDriver0
DIRDriver1: U404.4(C) ; port DIRDriver1
PLC_I0: Q401.3(C) R402.2 ; port PLC_I0
PLC_I1: Q402.3(C) R404.2 ; port PLC_I1
PLC_I6: Q403.3(C) R406.2 ; port PLC_I6
PLC_I7: Q404.3(C) R408.2 ; port PLC_I7
PLC_Q0: R409.1 ; port PLC_Q0
PLC_Q1: R410.1 ; port PLC_Q1
PLC_Q2: R411.2 ; port PLC_Q2
PLC_Q3: R412.2 ; port PLC_Q3
PWMDriver0: U401.1(OUT) U401.2(IN-) ; port PWMDriver0
PWMDriver1: U403.1(OUT) U403.2(IN-) ; port PWMDriver1
Signal_A_E0: Q401.1(B) R401.2 ; port Signal_A_E0
Signal_A_E1: Q403.1(B) R405.2 ; port Signal_A_E1
Signal_B_E0: Q402.1(B) R403.2 ; port Signal_B_E0
Signal_B_E1: Q404.1(B) R407.2 ; port Signal_B_E1
NetDZ401_2: DZ401.2(K) R409.2 U401.3(IN+)
NetDZ402_2: DZ402.2(K) R410.2 U403.3(IN+)
NetR411_1: R411.1 U402.1(A)
NetR412_1: R412.1 U404.1(A)

Not connected (* = marked no-connect by the designer): U401 7(OUT); U403 7(OUT)

### Notes on the sheet
- (in symbol TL082D, part A) A
- (in symbol TL082D, part B) B

### Library data of the parts
C401-C404 = Cap Ceramico SMD: Cap Ceramico SMD 0805; CODIGO RUF: *; PROVEEDOR: *; FABRICANTE: *
  C401 C403: Arrow: CL10A106MQ8NNNC; Digikey: 1276-1119-1-ND
  C402 C404: Arrow: C0603C104K5RACAUTO; Digikey: 399-6856-1-ND
Q401-Q404 = BC817-40: NPN General-purpose Transistor; Published: 17-Sep-2003; LatestRevisionDate: 12-Dec-2006; LatestRevisionNote: IPC-7351 Footprint Added.; DatasheetVersion: Jun-1999; PackageVersion: May-1999; PackageReference: SOT23; Publisher: Altium Limited; PackageDescription: 3-Pin SOT-23 Package 0.95 mm Pitch, 2.3 mm Lead Span; ComponentLink1Description: Manufacturer Link; ComponentLink1URL: http://www.semiconductors.philips.com/; ComponentLink2Description: Datasheet; ComponentLink2URL: http://www.semiconductors.philips.com/acrobat/datasheets/BC817_BC817W_BC337_5.pdf; Arrow: BC817-25-TP; Digikey: BC817-25-TPMSCT-ND
U401 U403 = TL082D: JFET-Input Operational Amplifier; Published: 16-Jan-2001; LatestRevisionDate: 13-Apr-2006; LatestRevisionNote: IPC-7351 Footprint Added.; DatasheetVersion: Feb-1999; PackageVersion: Jan-1998; PackageReference: D008; Publisher: Altium Limited; PackageDescription: 8-Pin Small Outline Integrated Circuit 1.27 mm Pitch; Code_IPC: SOIC127P600-8; ComponentLink1Description: Manufacturer Link; ComponentLink1URL: http://www.ti.com/; ComponentLink2Description: Datasheet; ComponentLink2URL: http://www-s.ti.com/sc/ds/tl082.pdf; Arrow: TL082IDR; Digikey: 296-15005-1-ND
U402 U404 = Optoisolator1: 4-Pin Phototransistor Optocoupler; Published: 24-Mar-1999; LatestRevisionDate: 04-Mar-2005; LatestRevisionNote: Sch pins 3 & 4 Swapped.; DatasheetVersion: Nov-2003; PackageReference: DIP-4; Publisher: Altium Limited; Arrow: TPC817MB C9G; Digikey: TPC817MBC9G-ND
DZ401 DZ402 = Diodo Zenner SMD: VALOR: *; PROVEEDOR: *; CODIGO RUF: *; FABRICANTE: *; Arrow: TLZ10C-GS08; Digikey: 112-TLZ10C-GS08CT-ND
R401-R412 = Res SMD: CODIGO RUF: *; PROVEEDOR: *; FABRICANTE: *
  R401-R410: Arrow: MCT06030C1002FP500; Digikey: RMCF0603FT10K0CT-ND
  R411 R412: Arrow: RC0805FR-074K7L; Digikey: 311-4.70KCRCT-ND

## Sheet UVC_Controller.SchDoc
size A4
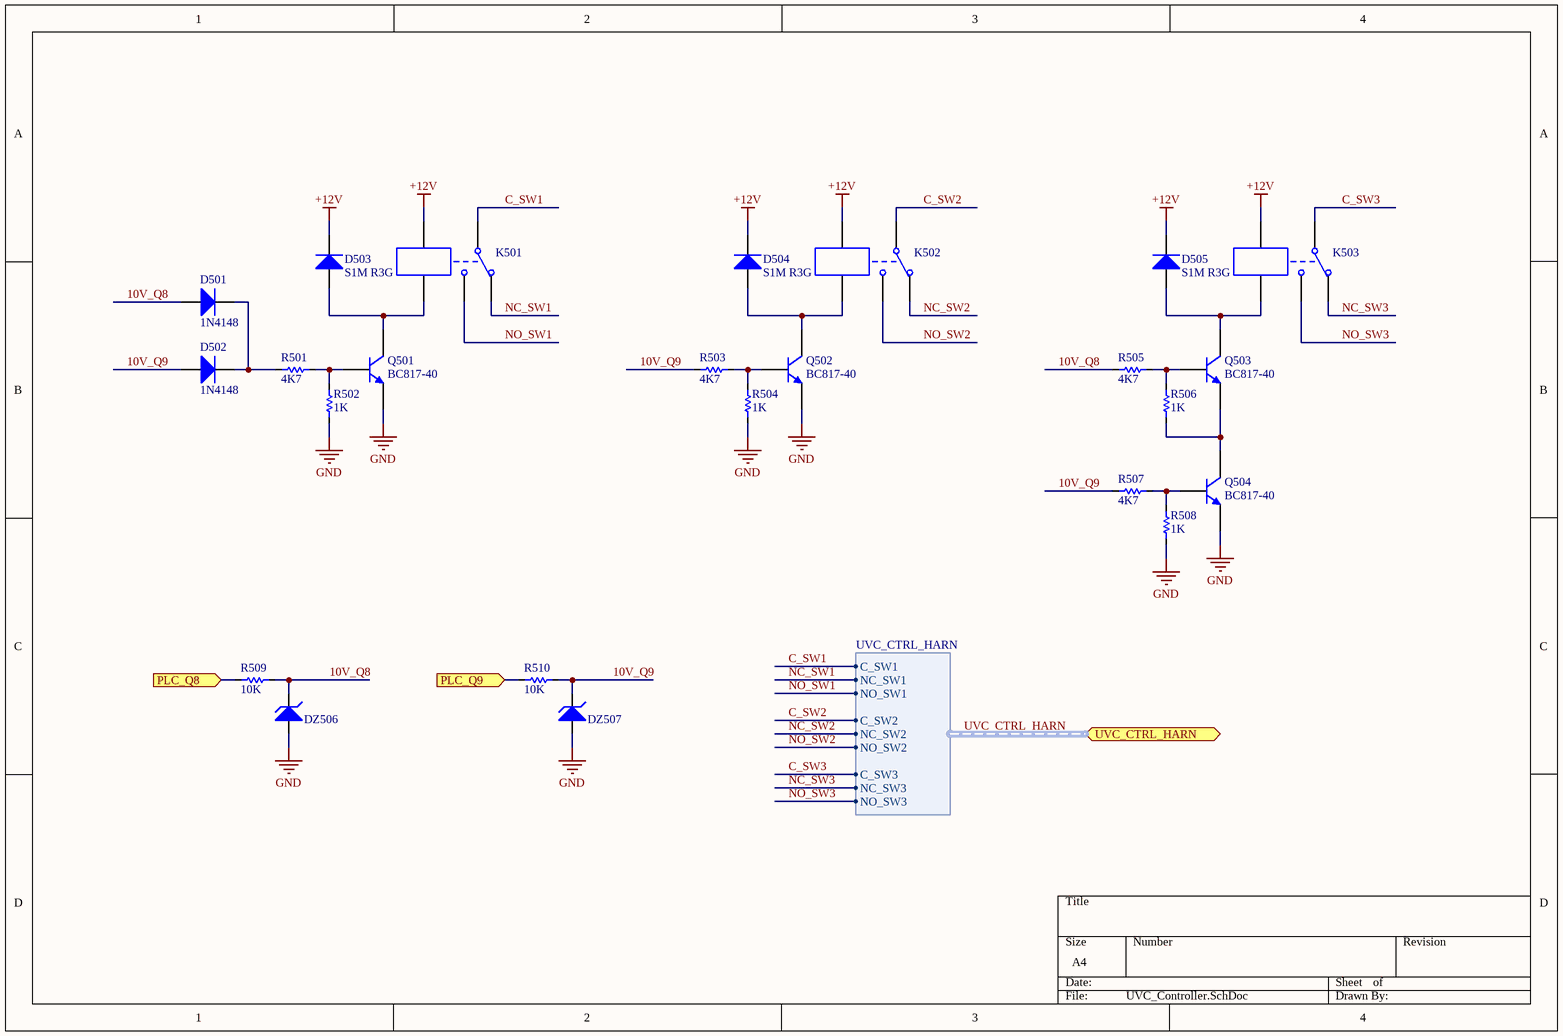
[diagram p5: UVC_Controller.SchDoc]

### Parts
D501  VALOR: 1N4148  [SOD-80]  (hidden comment: Diodo Rectificador SMD)
D502  VALOR: 1N4148  [SOD-80]  (hidden comment: Diodo Rectificador SMD)
D503  VALOR: S1M R3G  [DO-214]  (hidden comment: Diodo Rectificador SMD)
D504  VALOR: S1M R3G  [DO-214]  (hidden comment: Diodo Rectificador SMD)
D505  VALOR: S1M R3G  [DO-214]  (hidden comment: Diodo Rectificador SMD)
DZ506  Diodo Zenner SMD  [SOD-80]  (value not drawn)
DZ507  Diodo Zenner SMD  [SOD-80]  (value not drawn)
K501  Relay-SPDT  [JS1-5V-F]  (value not drawn)
K502  Relay-SPDT  [JS1-5V-F]  (value not drawn)
K503  Relay-SPDT  [JS1-5V-F]  (value not drawn)
Q501  BC817-40  [SOT23_M]
Q502  BC817-40  [SOT23_M]
Q503  BC817-40  [SOT23_M]
Q504  BC817-40  [SOT23_M]
R501  VALOR: 4K7  [R0603]  (hidden comment: Res SMD)
R502  VALOR: 1K  [R0603]  (hidden comment: Res SMD)
R503  VALOR: 4K7  [R0603]  (hidden comment: Res SMD)
R504  VALOR: 1K  [R0603]  (hidden comment: Res SMD)
R505  VALOR: 4K7  [R0603]  (hidden comment: Res SMD)
R506  VALOR: 1K  [R0603]  (hidden comment: Res SMD)
R507  VALOR: 4K7  [R0603]  (hidden comment: Res SMD)
R508  VALOR: 1K  [R0603]  (hidden comment: Res SMD)
R509  VALOR: 10K  [R0603]  (hidden comment: Res SMD)
R510  VALOR: 10K  [R0603]  (hidden comment: Res SMD)

### Ports
PLC_Q8 (in), PLC_Q9 (in), UVC_CTRL_HARN (harness UVC_CTRL_HARN)

### Harnesses
UVC_CTRL_HARN: C_SW1, NC_SW1, NO_SW1, C_SW2, NC_SW2, NO_SW2, C_SW3, NC_SW3, NO_SW3

### Nets
+12V: D503.2(K) D504.2(K) D505.2(K) K501.4 K502.4 K503.4
GND: DZ506.1(A) DZ507.1(A) Q501.2(E) Q502.2(E) Q504.2(E) R502.2 R504.2 R508.2
10V_Q8: D501.1(A) DZ506.2(K) R505.2 R509.2
10V_Q9: D502.1(A) DZ507.2(K) R503.2 R507.2 R510.2
C_SW1: K501.1 ; port UVC_CTRL_HARN.C_SW1
C_SW2: K502.1 ; port UVC_CTRL_HARN.C_SW2
C_SW3: K503.1 ; port UVC_CTRL_HARN.C_SW3
NC_SW1: K501.2 ; port UVC_CTRL_HARN.NC_SW1
NC_SW2: K502.2 ; port UVC_CTRL_HARN.NC_SW2
NC_SW3: K503.2 ; port UVC_CTRL_HARN.NC_SW3
NO_SW1: K501.3 ; port UVC_CTRL_HARN.NO_SW1
NO_SW2: K502.3 ; port UVC_CTRL_HARN.NO_SW2
NO_SW3: K503.3 ; port UVC_CTRL_HARN.NO_SW3
PLC_Q8: R509.1 ; port PLC_Q8
PLC_Q9: R510.1 ; port PLC_Q9
NetD501_2: D501.2(K) D502.2(K) R501.2
NetD503_1: D503.1(A) K501.5 Q501.3(C)
NetD504_1: D504.1(A) K502.5 Q502.3(C)
NetD505_1: D505.1(A) K503.5 Q503.3(C)
NetQ501_1: Q501.1(B) R501.1 R502.1
NetQ502_1: Q502.1(B) R503.1 R504.1
NetQ503_1: Q503.1(B) R505.1 R506.1
NetQ503_2: Q503.2(E) Q504.3(C) R506.2
NetQ504_1: Q504.1(B) R507.1 R508.1

### Buses and harness runs
harness UVC_CTRL_HARN = port UVC_CTRL_HARN

### Library data of the parts
D501-D505 = Diodo Rectificador SMD: Diodo Rectificador; PROVEEDOR: *; CODIGO RUF: *; FABRIANTE: *
  D501 D502: Arrow: FDLL4148; Digikey: FDLL4148TR-ND
  D503-D505: Arrow: S1M R3G; Digikey: S1MR3GDKR-ND
K501-K503 = Relay-SPDT: Single-Pole Dual-Throw Relay; Published: 24-Mar-1999; LatestRevisionDate: 17-Jul-2002; LatestRevisionNote: Re-released for DXP Platform.; PackageReference: MODULE5B; Publisher: Altium Limited; Arrow: JS1-12V-F; Digikey: 255-2080-ND
Q501-Q504 = BC817-40: NPN General-purpose Transistor; Published: 17-Sep-2003; LatestRevisionDate: 12-Dec-2006; LatestRevisionNote: IPC-7351 Footprint Added.; DatasheetVersion: Jun-1999; PackageVersion: May-1999; PackageReference: SOT23; Publisher: Altium Limited; PackageDescription: 3-Pin SOT-23 Package 0.95 mm Pitch, 2.3 mm Lead Span; ComponentLink1Description: Manufacturer Link; ComponentLink1URL: http://www.semiconductors.philips.com/; ComponentLink2Description: Datasheet; ComponentLink2URL: http://www.semiconductors.philips.com/acrobat/datasheets/BC817_BC817W_BC337_5.pdf; Arrow: BC817-25-TP; Digikey: BC817-25-TPMSCT-ND
DZ506 DZ507 = Diodo Zenner SMD: VALOR: *; PROVEEDOR: *; CODIGO RUF: *; FABRICANTE: *; Arrow: TLZ10C-GS08; Digikey: 112-TLZ10C-GS08CT-ND
R501-R510 = Res SMD: CODIGO RUF: *; PROVEEDOR: *; FABRICANTE: *
  R501 R503 R505 R507: Arrow: RC0805FR-074K7L; Digikey: 311-4.70KCRCT-ND
  R502 R504 R506 R508: Arrow: RCA06031K00FKEA; Digikey: YAG2323CT-ND
  R509 R510: Arrow: MCT06030C1002FP500; Digikey: RMCF0603FT10K0CT-ND

## Sheet Connectors.SchDoc
size A4
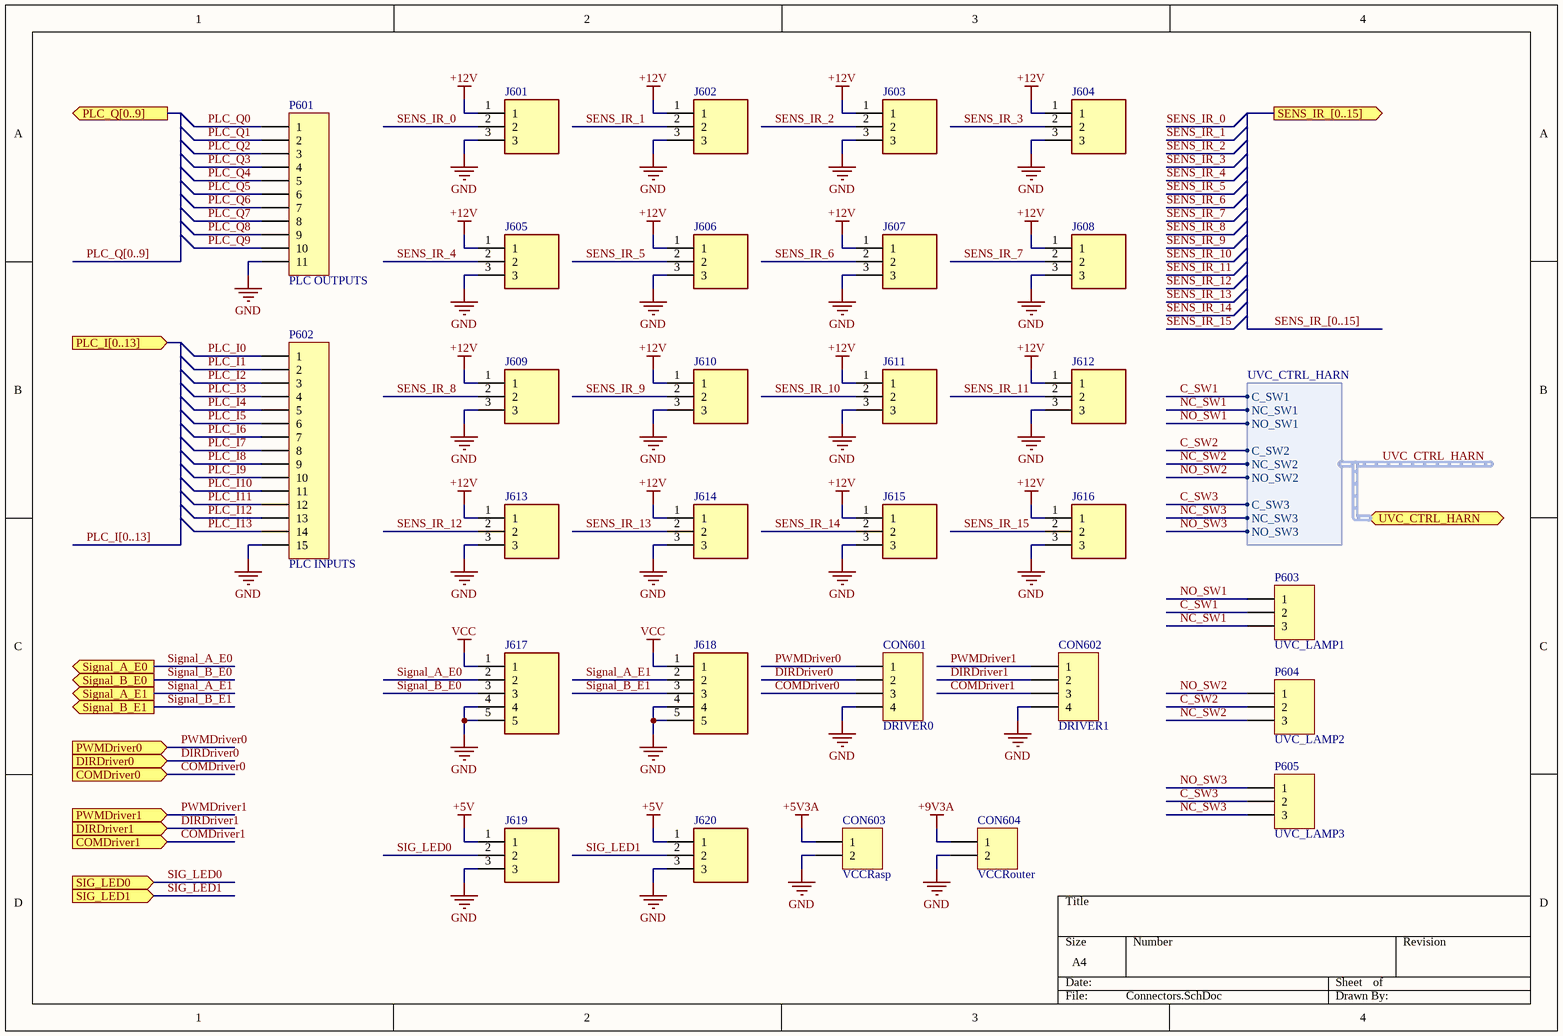
[diagram p6: Connectors.SchDoc]

### Parts
CON601  VALOR: DRIVER0  [PW4 - Recto]  (hidden comment: Header PW4 - Recto)
CON602  VALOR: DRIVER1  [PW4 - Recto]  (hidden comment: Header PW4 - Recto)
CON603  VALOR: VCCRasp  [PW2 - Recto]  (hidden comment: Header PW2 - Recto)
CON604  VALOR: VCCRouter  [PW2 - Recto]  (hidden comment: Header PW2 - Recto)
J601  TBL002A-350-03GR-2OR  [CUI_TBL002A-350-03GR-2OR]  (value not drawn)
J602  TBL002A-350-03GR-2OR  [CUI_TBL002A-350-03GR-2OR]  (value not drawn)
J603  TBL002A-350-03GR-2OR  [CUI_TBL002A-350-03GR-2OR]  (value not drawn)
J604  TBL002A-350-03GR-2OR  [CUI_TBL002A-350-03GR-2OR]  (value not drawn)
J605  TBL002A-350-03GR-2OR  [CUI_TBL002A-350-03GR-2OR]  (value not drawn)
J606  TBL002A-350-03GR-2OR  [CUI_TBL002A-350-03GR-2OR]  (value not drawn)
J607  TBL002A-350-03GR-2OR  [CUI_TBL002A-350-03GR-2OR]  (value not drawn)
J608  TBL002A-350-03GR-2OR  [CUI_TBL002A-350-03GR-2OR]  (value not drawn)
J609  TBL002A-350-03GR-2OR  [CUI_TBL002A-350-03GR-2OR]  (value not drawn)
J610  TBL002A-350-03GR-2OR  [CUI_TBL002A-350-03GR-2OR]  (value not drawn)
J611  TBL002A-350-03GR-2OR  [CUI_TBL002A-350-03GR-2OR]  (value not drawn)
J612  TBL002A-350-03GR-2OR  [CUI_TBL002A-350-03GR-2OR]  (value not drawn)
J613  TBL002A-350-03GR-2OR  [CUI_TBL002A-350-03GR-2OR]  (value not drawn)
J614  TBL002A-350-03GR-2OR  [CUI_TBL002A-350-03GR-2OR]  (value not drawn)
J615  TBL002A-350-03GR-2OR  [CUI_TBL002A-350-03GR-2OR]  (value not drawn)
J616  TBL002A-350-03GR-2OR  [CUI_TBL002A-350-03GR-2OR]  (value not drawn)
J617  TBL002A-350-05GR-2OR  [CUI_TBL002A-350-05GR-2OR]  (value not drawn)
J618  TBL002A-350-05GR-2OR  [CUI_TBL002A-350-05GR-2OR]  (value not drawn)
J619  TBL002A-350-03GR-2OR  [CUI_TBL002A-350-03GR-2OR]  (value not drawn)
J620  TBL002A-350-03GR-2OR  [CUI_TBL002A-350-03GR-2OR]  (value not drawn)
P601  PLC OUTPUTS  [SPTAF_1/15-3.5-EL_11POS]
P602  PLC INPUTS  [SPTAF_1/15-3.5-EL_15POS]
P603  UVC_LAMP1  [Terminal_3way_508]
P604  UVC_LAMP2  [Terminal_3way_508]
P605  UVC_LAMP3  [Terminal_3way_508]

### Ports
COMDriver0 (in), COMDriver1 (in), DIRDriver0 (in), DIRDriver1 (in), PLC_I[0..13] (in), PLC_Q[0..9] (out), PWMDriver0 (in), PWMDriver1 (in), SENS_IR_[0..15] (out), SIG_LED0 (in), SIG_LED1 (in), Signal_A_E0 (out), Signal_A_E1 (out), Signal_B_E0 (out), Signal_B_E1 (out), UVC_CTRL_HARN (harness UVC_CTRL_HARN)

### Harnesses
UVC_CTRL_HARN: C_SW1, NC_SW1, NO_SW1, C_SW2, NC_SW2, NO_SW2, C_SW3, NC_SW3, NO_SW3

### Nets
+5V: J619.1 J620.1
+5V3A: CON603.1
+9V3A: CON604.1
+12V: J601.1 J602.1 J603.1 J604.1 J605.1 J606.1 J607.1 J608.1 J609.1 J610.1 J611.1 J612.1 J613.1 J614.1 J615.1 J616.1
GND: CON601.4 CON602.4 CON603.2 CON604.2 J601.3 J602.3 J603.3 J604.3 J605.3 J606.3 J607.3 J608.3 J609.3 J610.3 J611.3 J612.3 J613.3 J614.3 J615.3 J616.3 J617.4 J617.5 J618.4 J618.5 J619.3 J620.3 P601.11 P602.15
VCC: J617.1 J618.1
C_SW1: P603.2 ; port UVC_CTRL_HARN.C_SW1
C_SW2: P604.2 ; port UVC_CTRL_HARN.C_SW2
C_SW3: P605.2 ; port UVC_CTRL_HARN.C_SW3
COMDriver0: CON601.3 ; port COMDriver0
COMDriver1: CON602.3 ; port COMDriver1
DIRDriver0: CON601.2 ; port DIRDriver0
DIRDriver1: CON602.2 ; port DIRDriver1
NC_SW1: P603.3 ; port UVC_CTRL_HARN.NC_SW1
NC_SW2: P604.3 ; port UVC_CTRL_HARN.NC_SW2
NC_SW3: P605.3 ; port UVC_CTRL_HARN.NC_SW3
NO_SW1: P603.1 ; port UVC_CTRL_HARN.NO_SW1
NO_SW2: P604.1 ; port UVC_CTRL_HARN.NO_SW2
NO_SW3: P605.1 ; port UVC_CTRL_HARN.NO_SW3
PLC_I0: P602.1
PLC_I1: P602.2
PLC_I2: P602.3
PLC_I3: P602.4
PLC_I4: P602.5
PLC_I5: P602.6
PLC_I6: P602.7
PLC_I7: P602.8
PLC_I8: P602.9
PLC_I9: P602.10
PLC_I10: P602.11
PLC_I11: P602.12
PLC_I12: P602.13
PLC_I13: P602.14
PLC_Q0: P601.1
PLC_Q1: P601.2
PLC_Q2: P601.3
PLC_Q3: P601.4
PLC_Q4: P601.5
PLC_Q5: P601.6
PLC_Q6: P601.7
PLC_Q7: P601.8
PLC_Q8: P601.9
PLC_Q9: P601.10
PWMDriver0: CON601.1 ; port PWMDriver0
PWMDriver1: CON602.1 ; port PWMDriver1
SENS_IR_0: J601.2
SENS_IR_1: J602.2
SENS_IR_2: J603.2
SENS_IR_3: J604.2
SENS_IR_4: J605.2
SENS_IR_5: J606.2
SENS_IR_6: J607.2
SENS_IR_7: J608.2
SENS_IR_8: J609.2
SENS_IR_9: J610.2
SENS_IR_10: J611.2
SENS_IR_11: J612.2
SENS_IR_12: J613.2
SENS_IR_13: J614.2
SENS_IR_14: J615.2
SENS_IR_15: J616.2
SIG_LED0: J619.2 ; port SIG_LED0
SIG_LED1: J620.2 ; port SIG_LED1
Signal_A_E0: J617.2 ; port Signal_A_E0
Signal_A_E1: J618.2 ; port Signal_A_E1
Signal_B_E0: J617.3 ; port Signal_B_E0
Signal_B_E1: J618.3 ; port Signal_B_E1

### Buses and harness runs
bus PLC_I[0..13] = port PLC_I[0..13]
bus PLC_Q[0..9] = port PLC_Q[0..9]
bus SENS_IR_[0..15] = port SENS_IR_[0..15]
harness UVC_CTRL_HARN = port UVC_CTRL_HARN

### Library data of the parts
CON601 CON602 = Header PW4 - Recto: Header PW - paso 0.156"; PROVEEDOR: *; FABRICANTE: *; CODIGO RUF: *; PART NUMBER: *; Arrow: B4P-VH(LF)(SN); Digikey: 455-1641-ND; Digikey Housing: 455-1185-ND; Digikey Pin: 455-1319-1-ND
CON603 CON604 = Header PW2 - Recto: Header PW - paso 0.156"; PROVEEDOR: *; FABRICANTE: *; CODIGO RUF: *; PART NUMBER: *; Arrow: B2P-VH (LF) (SN); Digikey: 455-1639-ND; Digikey Housing: 455-1183-ND; Digikey Pin: 455-1319-1-ND
J601-J616 J619 J620 = TBL002A-350-03GR-2OR: 1~24 Poles, Screwless, 45°, 3.50 Pitch, 24~20 (AWG), Terminal Block Connector; MF: CUI Devices; MP: TBL002A-350-03GR-2OR; Value: *; Availability: Good; Package: None; Price: None; SnapEDA_Link: https://www.snapeda.com/parts/TBL002A-350-03GR-2OR/CUI%20Devices/view-part/3233282/?ref=snap; Purchase-URL: https://pricing.snapeda.com/search/part/TBL002A-350-03GR-2OR/?ref=eda; CUI_purchase_URL: https://www.cuidevices.com/product/interconnect/connectors/terminal-blocks/tbl002a-350-series?utm_source=snapeda.com&utm_medium=referral&utm_campaign=snapedaBOM; Check_prices: https://www.snapeda.com/parts/TBL002A-350-03GR-2OR/CUI%20Devices/view-part/3233282/?ref=eda; Arrow: TBL002A-350-03GR-2OR; Digikey: 102-6380-ND
J617 J618 = TBL002A-350-05GR-2OR: 1~24 Poles, Screwless, 45°, 3.50 Pitch, 24~20 (AWG), Terminal Block Connector; MF: CUI Devices; Price: None; Check_prices: https://www.snapeda.com/parts/TBL002A-350-05GR-2OR/CUI%20Devices/view-part/3232875/?ref=eda; Package: None; Purchase-URL: https://pricing.snapeda.com/search/part/TBL002A-350-05GR-2OR/?ref=eda; SnapEDA_Link: https://www.snapeda.com/parts/TBL002A-350-05GR-2OR/CUI%20Devices/view-part/3232875/?ref=snap; CUI_purchase_URL: https://www.cuidevices.com/product/interconnect/connectors/terminal-blocks/tbl002a-350-series?utm_source=snapeda.com&utm_medium=referral&utm_campaign=snapedaBOM; Value: *; MP: TBL002A-350-05GR-2OR; Availability: Warning; Arrow: TBL002A-350-05GR-2OR; Digikey: 102-6382-ND
P601 = Header 11: Header, 11-Pin; LatestRevisionDate: 17-Jul-2002; LatestRevisionNote: Re-released for DXP Platform.; Publisher: Altium Limited; Arrow: 1862136; Digikey: 277-12163-ND
P602 = Header 15: Header, 15-Pin; LatestRevisionDate: 17-Jul-2002; LatestRevisionNote: Re-released for DXP Platform.; Publisher: Altium Limited; Arrow: 1862259; Digikey: 277-12167-ND
P603-P605 = Header 3: Header, 3-Pin; LatestRevisionDate: 17-Jul-2002; LatestRevisionNote: Re-released for DXP Platform.; Publisher: Altium Limited; Arrow: TB006-508-03BE; Digikey: 102-6192-ND

## Nets that join several sheets
+5V: Indicator_LEDs_RGB (C105.1 C106.1 D107.1 U105.8), Power_Supply (C309.1 C310.1 L301.2 R303.1), Connectors (J619.1 J620.1)
+5V3A: Power_Supply (C313.1 C314.1 L303.2 R309.1), Connectors (CON603.1)
+9V3A: Power_Supply (C315.1 C316.1 L304.2 R311.1), Connectors (CON604.1)
+12V: Sensor_Multiplexation (23 pins), Power_Supply (C311.1 C312.1 L302.2 R307.1), Motor_Encoders (6 pins), UVC_Controller (6 pins), Connectors (16 pins)
GND: Circuit (TOR101.1 TOR102.1 TOR103.1 TOR104.1), Indicator_LEDs_RGB (22 pins), Sensor_Multiplexation (14 pins), Power_Supply (36 pins), Motor_Encoders (18 pins), UVC_Controller (8 pins), Connectors (28 pins)
VCC: Sensor_Multiplexation (C203.1 C204.1 R242.2), Power_Supply (16 pins), Motor_Encoders (8 pins), Connectors (J617.1 J618.1)
C_SW1: UVC_Controller (K501.1), Connectors (P603.2)
C_SW2: UVC_Controller (K502.1), Connectors (P604.2)
C_SW3: UVC_Controller (K503.1), Connectors (P605.2)
COMDriver0: Motor_Encoders (U402.3), Connectors (CON601.3)
COMDriver1: Motor_Encoders (U404.3), Connectors (CON602.3)
DIRDriver0: Motor_Encoders (U402.4), Connectors (CON601.2)
DIRDriver1: Motor_Encoders (U404.4), Connectors (CON602.2)
NC_SW1: UVC_Controller (K501.2), Connectors (P603.3)
NC_SW2: UVC_Controller (K502.2), Connectors (P604.3)
NC_SW3: UVC_Controller (K503.2), Connectors (P605.3)
NO_SW1: UVC_Controller (K501.3), Connectors (P603.1)
NO_SW2: UVC_Controller (K502.3), Connectors (P604.1)
NO_SW3: UVC_Controller (K503.3), Connectors (P605.1)
PLC_Q0: Indicator_LEDs_RGB (R105.1), Motor_Encoders (R409.1)
PLC_Q1: Indicator_LEDs_RGB (R106.1), Motor_Encoders (R410.1)
PLC_Q8: Indicator_LEDs_RGB (R103.1), UVC_Controller (R509.1)
PLC_Q9: Indicator_LEDs_RGB (R104.1), UVC_Controller (R510.1)
PWMDriver0: Motor_Encoders (U401.1 U401.2), Connectors (CON601.1)
PWMDriver1: Motor_Encoders (U403.1 U403.2), Connectors (CON602.1)
SENS_IR_0: Sensor_Multiplexation (R201.1 R224.2), Connectors (J601.2)
SENS_IR_1: Sensor_Multiplexation (R202.1 R223.2), Connectors (J602.2)
SENS_IR_2: Sensor_Multiplexation (R203.1 R222.2), Connectors (J603.2)
SENS_IR_3: Sensor_Multiplexation (R204.1 R221.2), Connectors (J604.2)
SENS_IR_4: Sensor_Multiplexation (R205.1 R220.2), Connectors (J605.2)
SENS_IR_5: Sensor_Multiplexation (R206.1 R219.2), Connectors (J606.2)
SENS_IR_6: Sensor_Multiplexation (R207.1 R218.2), Connectors (J607.2)
SENS_IR_7: Sensor_Multiplexation (R208.1 R217.2), Connectors (J608.2)
SENS_IR_8: Sensor_Multiplexation (R209.1 R232.2), Connectors (J609.2)
SENS_IR_9: Sensor_Multiplexation (R210.1 R231.2), Connectors (J610.2)
SENS_IR_10: Sensor_Multiplexation (R211.1 R230.2), Connectors (J611.2)
SENS_IR_11: Sensor_Multiplexation (R212.1 R229.2), Connectors (J612.2)
SENS_IR_12: Sensor_Multiplexation (R213.1 R228.2), Connectors (J613.2)
SENS_IR_13: Sensor_Multiplexation (R214.1 R227.2), Connectors (J614.2)
SENS_IR_14: Sensor_Multiplexation (R215.1 R226.2), Connectors (J615.2)
SENS_IR_15: Sensor_Multiplexation (R216.1 R225.2), Connectors (J616.2)
SIG_LED0: Indicator_LEDs_RGB (U105.1 U105.2), Connectors (J619.2)
SIG_LED1: Indicator_LEDs_RGB (U105.6 U105.7), Connectors (J620.2)
Signal_A_E0: Motor_Encoders (Q401.1 R401.2), Connectors (J617.2)
Signal_A_E1: Motor_Encoders (Q403.1 R405.2), Connectors (J618.2)
Signal_B_E0: Motor_Encoders (Q402.1 R403.2), Connectors (J617.3)
Signal_B_E1: Motor_Encoders (Q404.1 R407.2), Connectors (J618.3)